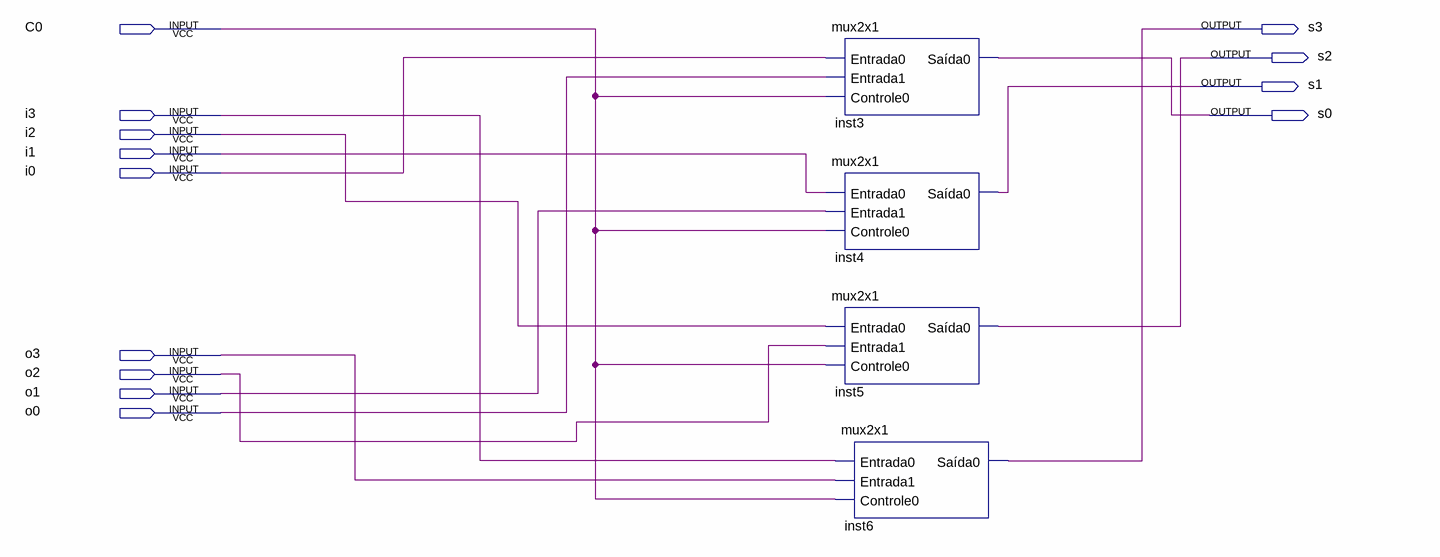
[diagram p0: schematic sheet]
// Quartus schematic mux8x4.bdf as structural Verilog: 4 symbols, 13 pins
module mux8x4 (
  input  C0,
  input  i3,
  input  i2,
  input  i1,
  input  i0,
  input  o3,
  input  o2,
  input  o1,
  input  o0,
  output s3,
  output s2,
  output s1,
  output s0
);

  mux2x1 inst3 (.Entrada0(i0), .Entrada1(o0), .Controle0(C0), .\Saída0 (s0));
  mux2x1 inst4 (.Entrada0(i1), .Entrada1(o1), .Controle0(C0), .\Saída0 (s1));
  mux2x1 inst5 (.Entrada0(i2), .Entrada1(o2), .Controle0(C0), .\Saída0 (s2));
  mux2x1 inst6 (.Entrada0(i3), .Entrada1(o3), .Controle0(C0), .\Saída0 (s3));
endmodule
